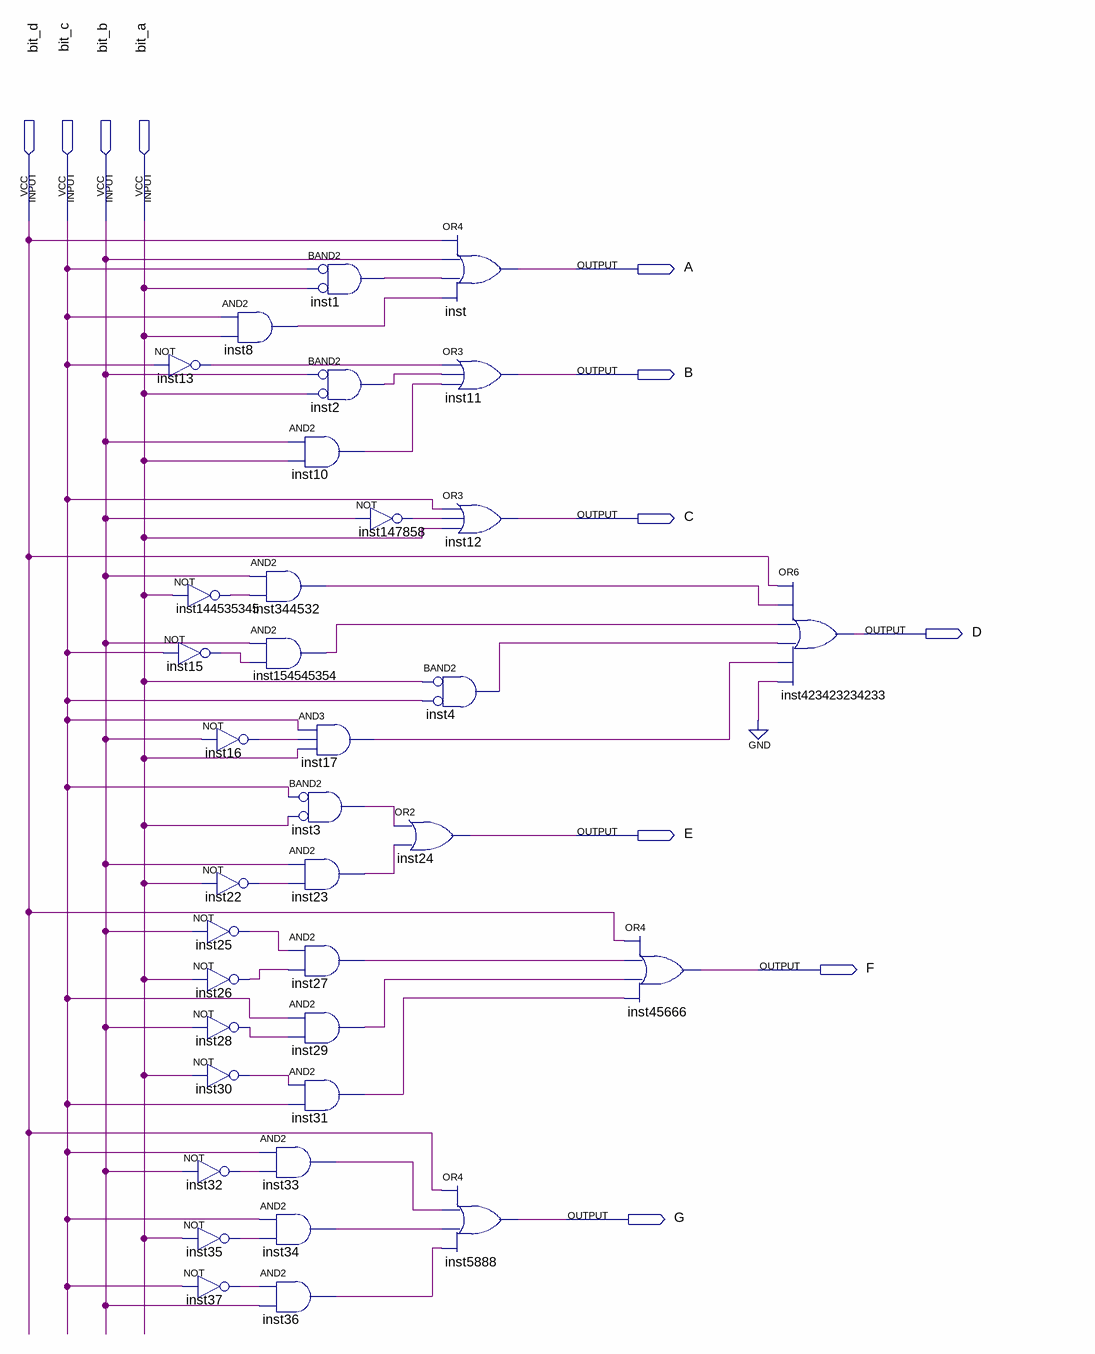
[diagram p0: schematic sheet]
// Quartus schematic Decodificador7seg.bdf as structural Verilog: 36 symbols, 11 pins
module Decodificador7seg (
  input  bit_d,
  input  bit_c,
  input  bit_b,
  input  bit_a,
  output A,
  output B,
  output C,
  output D,
  output E,
  output F,
  output G
);

  wire inst1_out, inst2_out, inst3_out, inst4_out, inst8_out, inst10_out, inst13_out, inst15_out, inst16_out,
       inst17_out, inst22_out, inst23_out, inst25_out, inst26_out, inst27_out, inst28_out, inst29_out,
       inst30_out, inst31_out, inst32_out, inst33_out, inst34_out, inst35_out, inst36_out, inst37_out,
       inst147858_out, inst344532_out, inst144535345_out, inst154545354_out;

  not inst13 (inst13_out, bit_c);
  not inst144535345 (inst144535345_out, bit_a);
  not inst15 (inst15_out, bit_c);
  not inst16 (inst16_out, bit_b);
  not inst22 (inst22_out, bit_a);
  not inst25 (inst25_out, bit_b);
  not inst26 (inst26_out, bit_a);
  not inst28 (inst28_out, bit_b);
  not inst30 (inst30_out, bit_a);
  not inst32 (inst32_out, bit_b);
  not inst35 (inst35_out, bit_a);
  not inst37 (inst37_out, bit_c);
  and inst8 (inst8_out, bit_c, bit_a);
  and inst344532 (inst344532_out, bit_b, inst144535345_out);
  and inst154545354 (inst154545354_out, bit_b, inst15_out);
  and inst33 (inst33_out, bit_c, inst32_out);
  and inst34 (inst34_out, bit_c, inst35_out);
  and inst36 (inst36_out, inst37_out, bit_b);
  and inst1 (inst1_out, ~bit_c, ~bit_a);  // BAND2
  and inst2 (inst2_out, ~bit_b, ~bit_a);  // BAND2
  and inst10 (inst10_out, bit_b, bit_a);
  not inst147858 (inst147858_out, bit_b);
  and inst17 (inst17_out, bit_c, inst16_out, bit_a);
  and inst3 (inst3_out, ~bit_c, ~bit_a);  // BAND2
  and inst23 (inst23_out, bit_b, inst22_out);
  and inst27 (inst27_out, inst25_out, inst26_out);
  and inst29 (inst29_out, bit_c, inst28_out);
  and inst31 (inst31_out, inst30_out, bit_c);
  and inst4 (inst4_out, ~bit_a, ~bit_c);  // BAND2
  or inst24 (E, inst3_out, inst23_out);
  or inst (A, bit_d, bit_b, inst1_out, inst8_out);
  or inst11 (B, inst13_out, inst2_out, inst10_out);
  or inst12 (C, bit_c, inst147858_out, bit_a);
  or inst5888 (G, bit_d, inst33_out, inst34_out, inst36_out);
  or inst45666 (F, bit_d, inst27_out, inst29_out, inst31_out);
  or inst423423234233 (D, bit_d, inst344532_out, inst154545354_out, inst4_out, inst17_out, 1'b0);
endmodule
